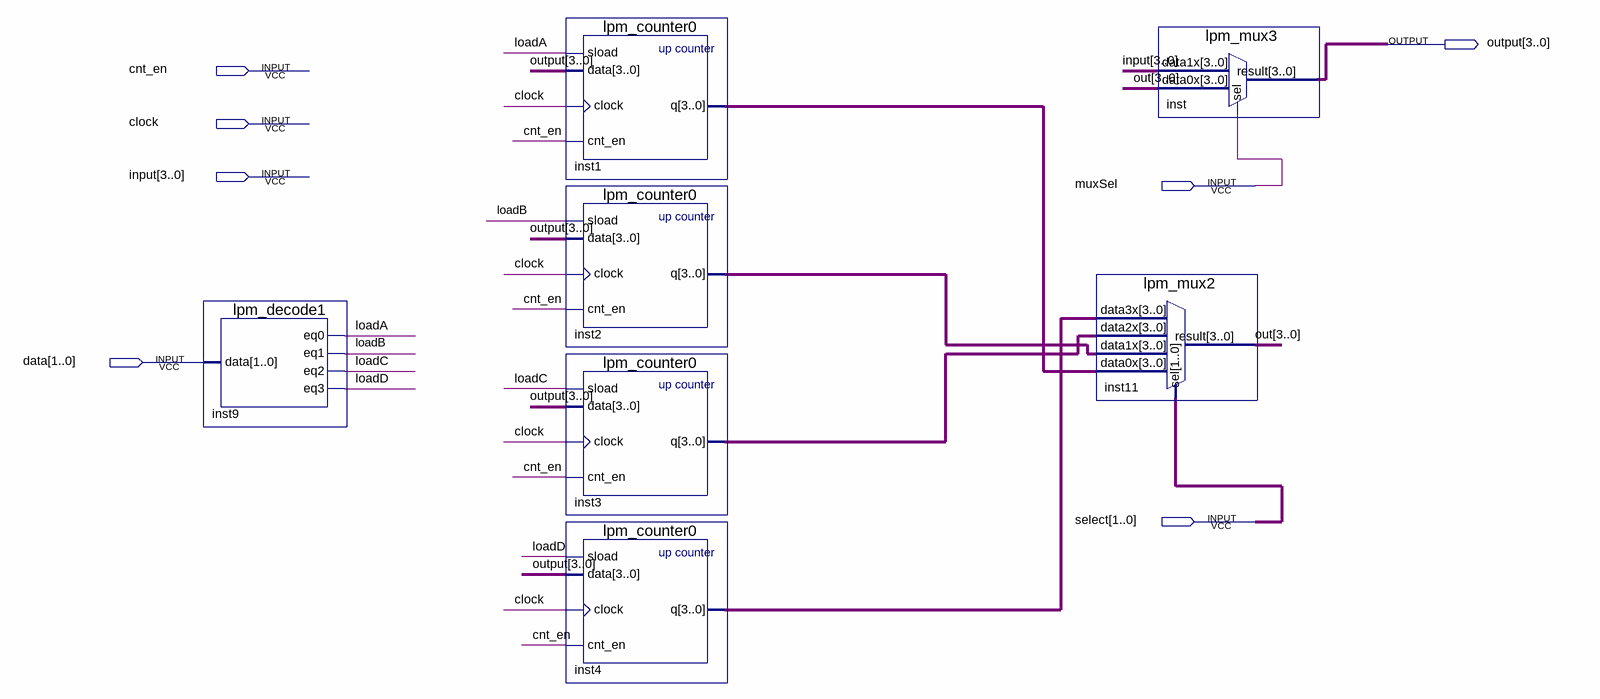
[diagram p0: schematic sheet]
// Quartus schematic onur.bdf as structural Verilog: 7 symbols, 7 pins
module onur (
  input  cnt_en,
  input  clock,
  input  [3:0] \input ,
  input  muxSel,
  input  [1:0] data,
  input  [1:0] select,
  output [3:0] \output 
);

  wire loadA, loadB, loadC, loadD;
  wire [3:0] inst1_q, inst2_q, inst3_q, inst4_q, out;

  lpm_decode1 inst9 (.data(data), .eq0(loadA), .eq1(loadB), .eq2(loadC), .eq3(loadD));
  lpm_counter0 inst1 (.sload(loadA), .data(\output ), .clock(clock), .cnt_en(cnt_en), .q(inst1_q));
  lpm_counter0 inst2 (.sload(loadB), .data(\output ), .clock(clock), .cnt_en(cnt_en), .q(inst2_q));
  lpm_counter0 inst3 (.sload(loadC), .data(\output ), .clock(clock), .cnt_en(cnt_en), .q(inst3_q));
  lpm_counter0 inst4 (.sload(loadD), .data(\output ), .clock(clock), .cnt_en(cnt_en), .q(inst4_q));
  lpm_mux2 inst11 (.data3x(inst4_q), .data2x(inst3_q), .data1x(inst2_q), .data0x(inst1_q), .sel(select), .result(out));
  lpm_mux3 inst (.data1x(\input ), .data0x(out), .sel(muxSel), .result(\output ));
endmodule
